# Altium schematic sheet cpupwrbackup.SchDoc: JKA 2.0 原理图
size A4; Author: JACK; CompanyName: 北京康洁之晨水处理技术有限公司; DrawnBy: 郭相炳; Organization: 北京康洁; DocumentNumber: 6; Revision: 2.0; SheetNumber: 6; SheetTotal: 6; ImagePath: E:\JKAdoc\data\LOGO.jpg; ProjectName: JKA2.0
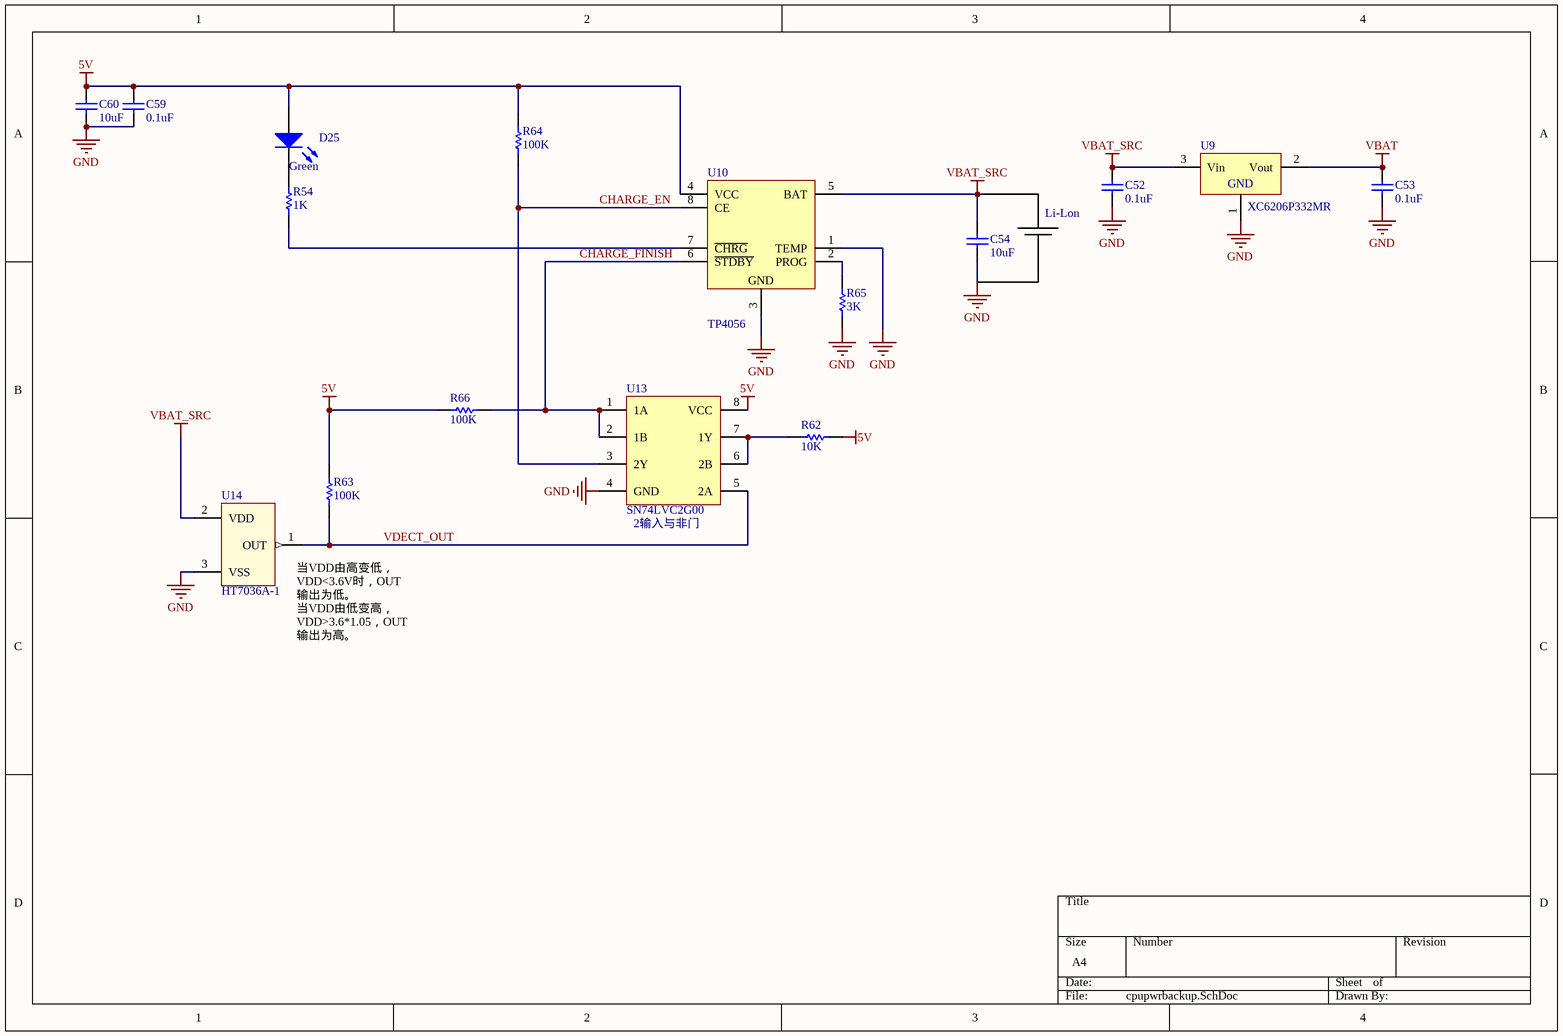
[diagram p0: cpupwrbackup.SchDoc]

## Parts
C52  0.1uF  [CAPC2012M]
C53  0.1uF  [CAPC2012M]
C54  10uF  [CAPC2012M]
C59  0.1uF  [CAPC2012M]
C60  10uF  [CAPC2012M]
D25  Green  [CD2012-0805]
R54  1K  [RESC2012M]
R62  10K  [RESC2012M]
R63  100K  [RESC2012M]
R64  100K  [RESC2012M]
R65  3K  [RESC2012M]
R66  100K  [RESC2012M]
U9  XC6206P332MR  [SOT-23_M]
U10  TP4056  [NSO8_TP4056]
U13  SN74LVC2G00  [PDSO-G8]
U14  HT7036A-1  [SOT89M]

## Nets
5V: C59.1 C60.1 D25.1(A) R62.1 R63.2 R64.2 R66.2 U10.4(VCC) U13.8(VCC)
GND: C52.2 C53.2 C54.2 C59.2 C60.2 R65.1 U9.1(GND) U10.1(TEMP) U10.3(GND) U13.4(GND) U14.3(VSS)
VBAT: C53.1 U9.2(Vout)
VBAT_SRC: C52.1 C54.1 U9.3(Vin) U10.5(BAT) U14.2(VDD)
CHARGE_EN: R64.1 U10.8(CE) U13.3(2Y)
CHARGE_FINISH: R66.1 U10.6(~{STDBY}) U13.1(1A) U13.2(1B)
VDECT_OUT: R63.1 U13.5(2A) U14.1(OUT)
NetD25_2: D25.2(K) R54.1
NetR54_2: R54.2 U10.7(~{CHRG})
NetR62_2: R62.2 U13.6(2B) U13.7(1Y)
NetR65_2: R65.2 U10.2(PROG)

## Notes on the sheet
- (near C52) Li-Lon
- (near U13) 2输入与非门
- (near U14) 当VDD由高变低，VDD<3.6V时，OUT输出为低。
  当VDD由低变高，VDD>3.6*1.05，OUT输出为高。

## Library data of the parts
C52-C54 C59 C60 = Cap: Capacitor; Value: 1nF; Published: 8-Jun-2000; LatestRevisionDate: 17-Jul-2002; LatestRevisionNote: Re-released for DXP Platform.; PackageReference: RAD-0.3; Publisher: Altium Limited
D25 = LED1: Green LED,Output indicate.; Published: 8-Jun-2000; LatestRevisionDate: 08-Jul-2005; LatestRevisionNote: Mech Layer 1 removed.; PackageReference: LED-1; Publisher: Altium Limited
R54 R63-R66 = Res1: Resistor; Value: 10K; Published: 8-Jun-2000; LatestRevisionDate: 17-Jul-2002; LatestRevisionNote: Re-released for DXP Platform.; PackageReference: AXIAL-0.3; Publisher: Altium Limited
R62 = Res1: Resistor; Published: 8-Jun-2000; LatestRevisionDate: 17-Jul-2002; LatestRevisionNote: Re-released for DXP Platform.; PackageReference: AXIAL-0.3; Publisher: Altium Limited; Value: 10K
U9 = XC6206: 250mA Low ESR Dropout Linear Regulator
U10 = TP4056: 锂电池充电管理
U13 = SN74LVC2G00: Dual 2-input positive-NAND gate
U14 = HT70XX